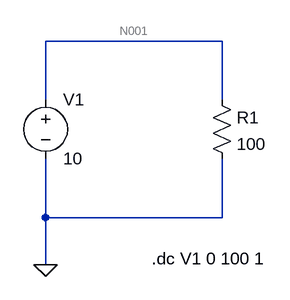
[diagram p0: schematic DC-sweep.asc]
DC-sweep.asc, the LTspice schematic file:
Version 4
SHEET 1 880 680
WIRE 368 48 128 48
WIRE 128 128 128 48
WIRE 368 128 368 48
WIRE 128 288 128 208
WIRE 368 288 368 208
WIRE 368 288 128 288
WIRE 128 352 128 288
FLAG 128 352 0
SYMBOL voltage 128 112 R0
SYMATTR InstName V1
SYMATTR Value 10
SYMBOL res 352 112 R0
SYMATTR InstName R1
SYMATTR Value 100
TEXT 272 344 Left 2 !.dc V1 0 100 1

The netlist it stands for:
* DC-sweep.asc
V1 N001 0 10
R1 N001 0 100
.dc V1 0 100 1
.backanno
.end

* Results of the author's LTspice run, read from the files saved beside the schematic
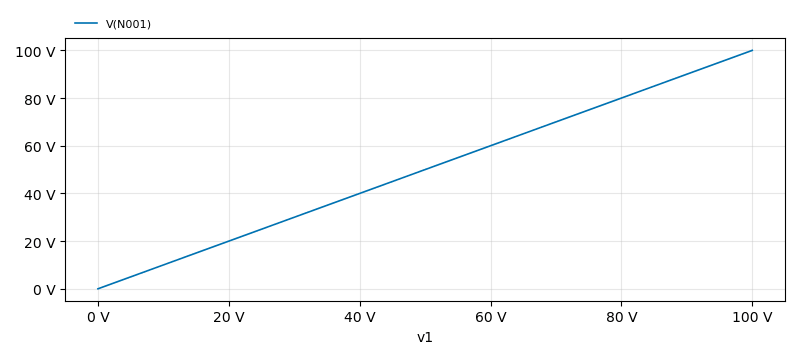
[diagram p1: DC transfer characteristic of DC-sweep.asc, plotted from the saved traces]
* DC transfer characteristic, 1 run:
*   V(N001): 0 V at v1=0 V, 100 V at v1=100 V, min 0 V, max 100 V